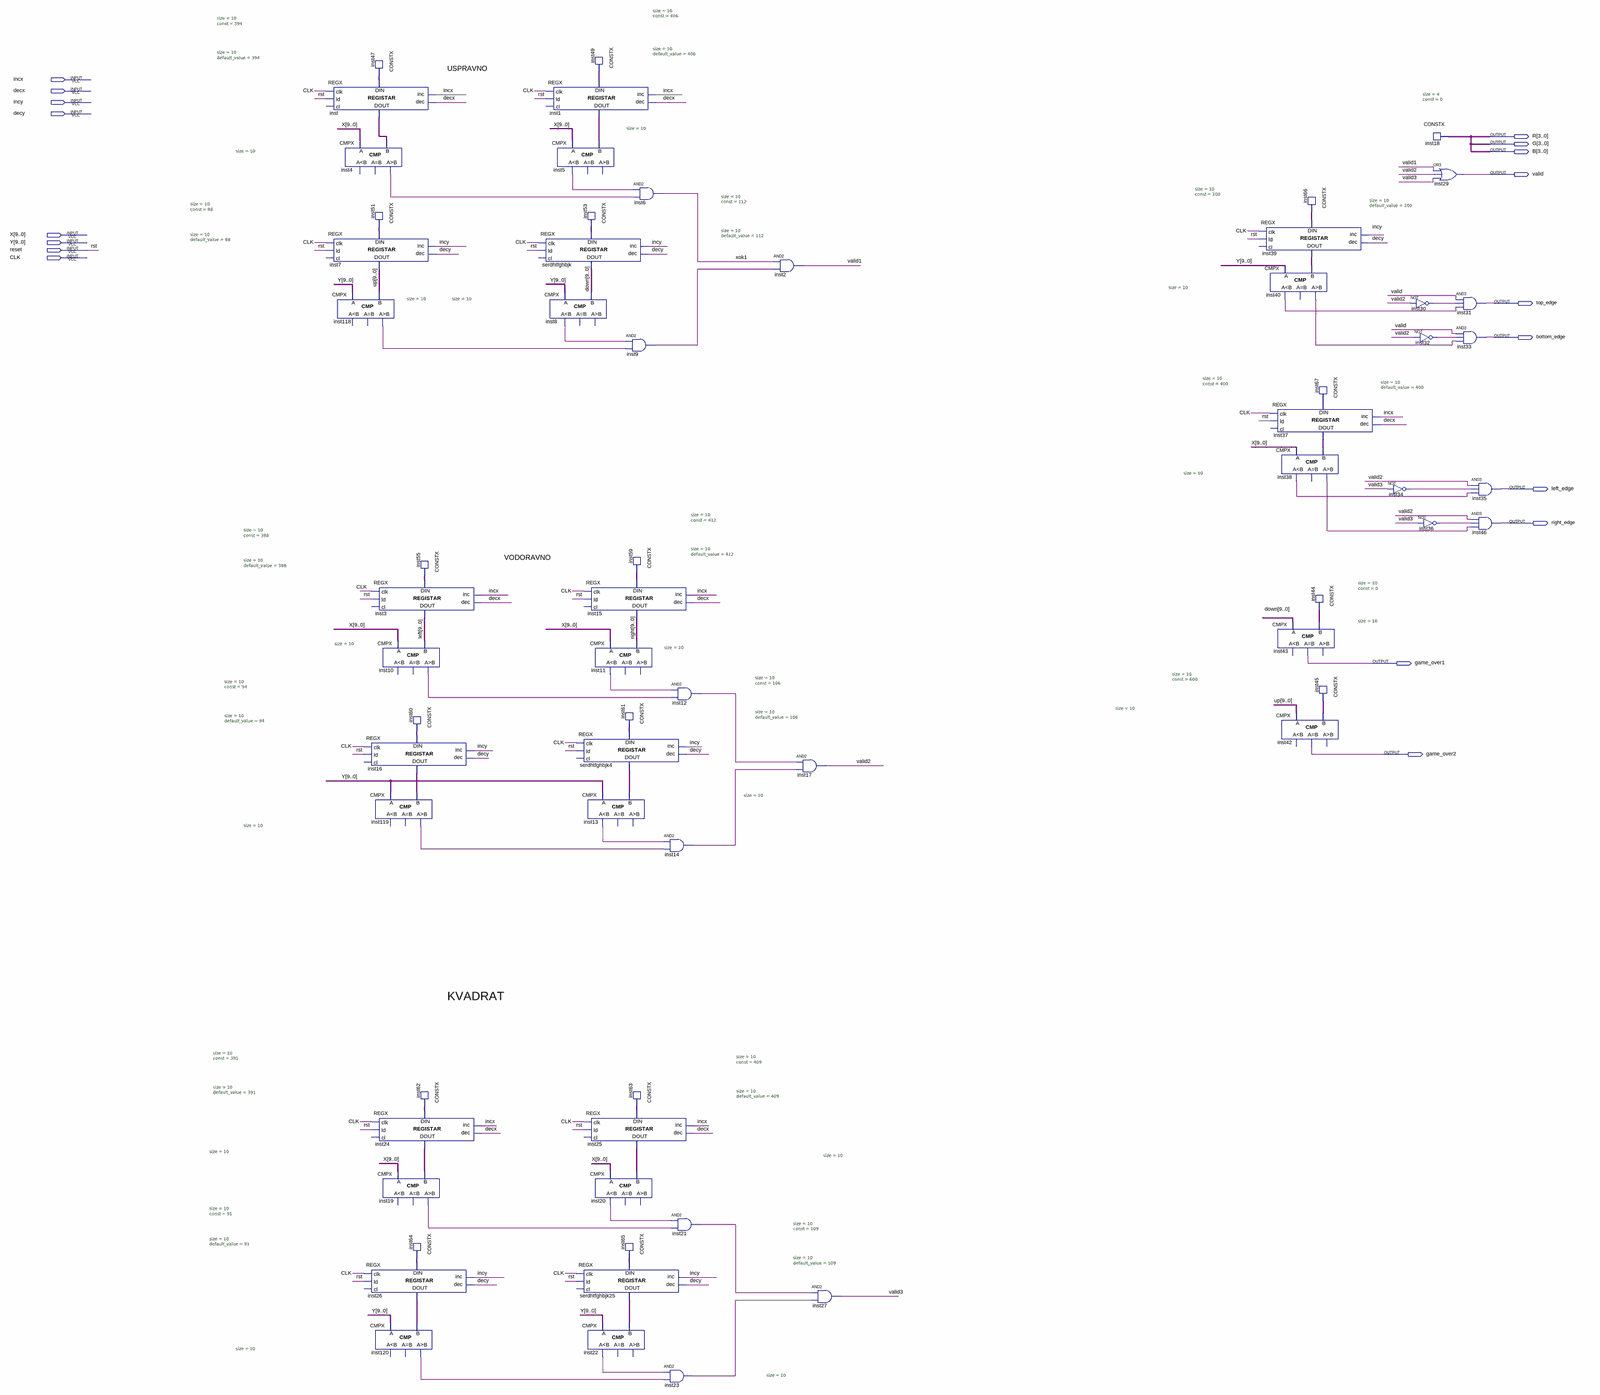
[diagram p0: schematic sheet, whole]
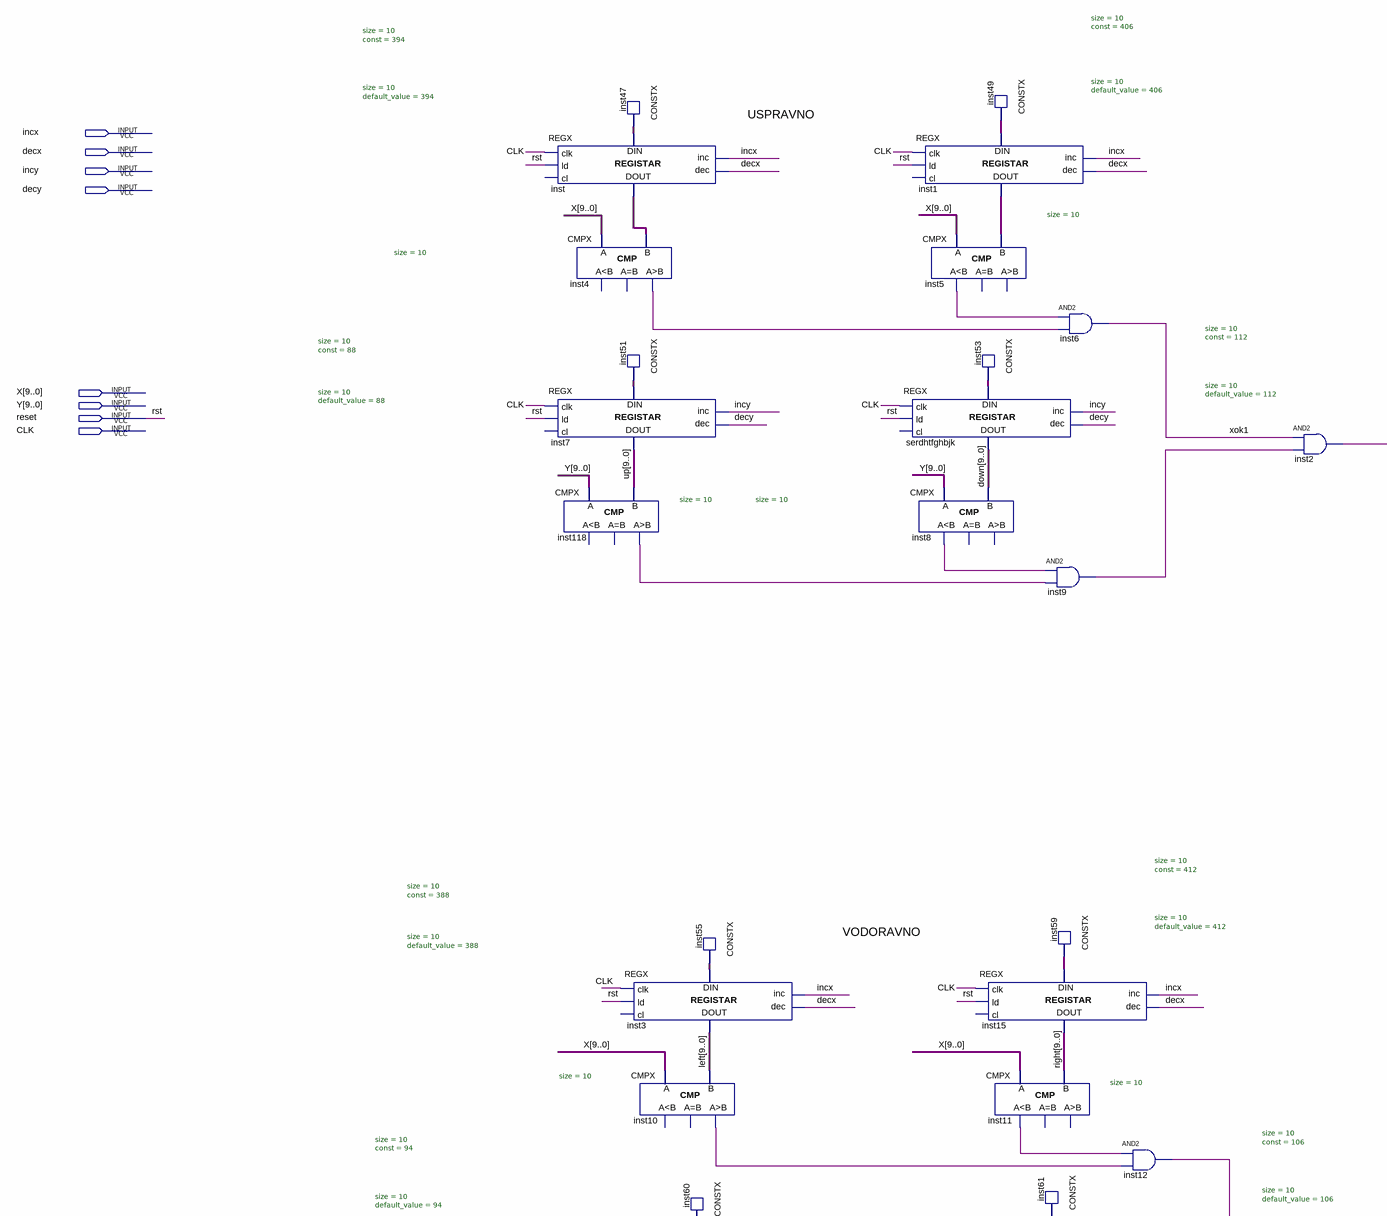
[diagram p1: schematic sheet, upper left part]
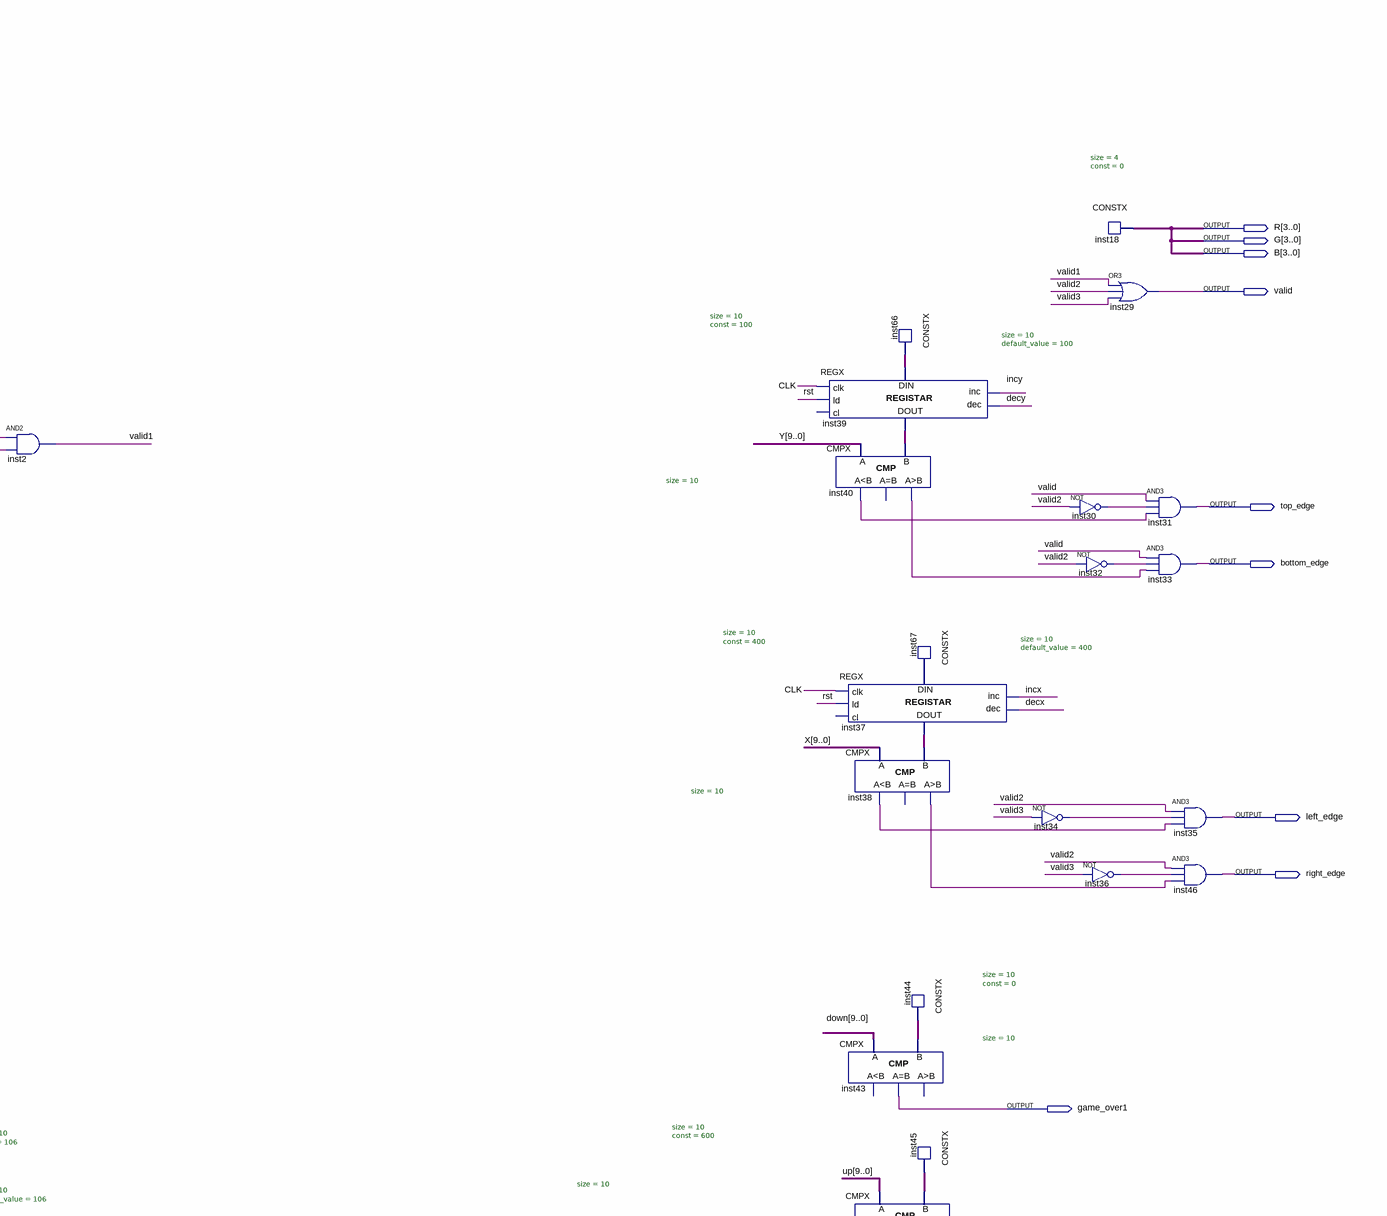
[diagram p2: schematic sheet, upper right part]
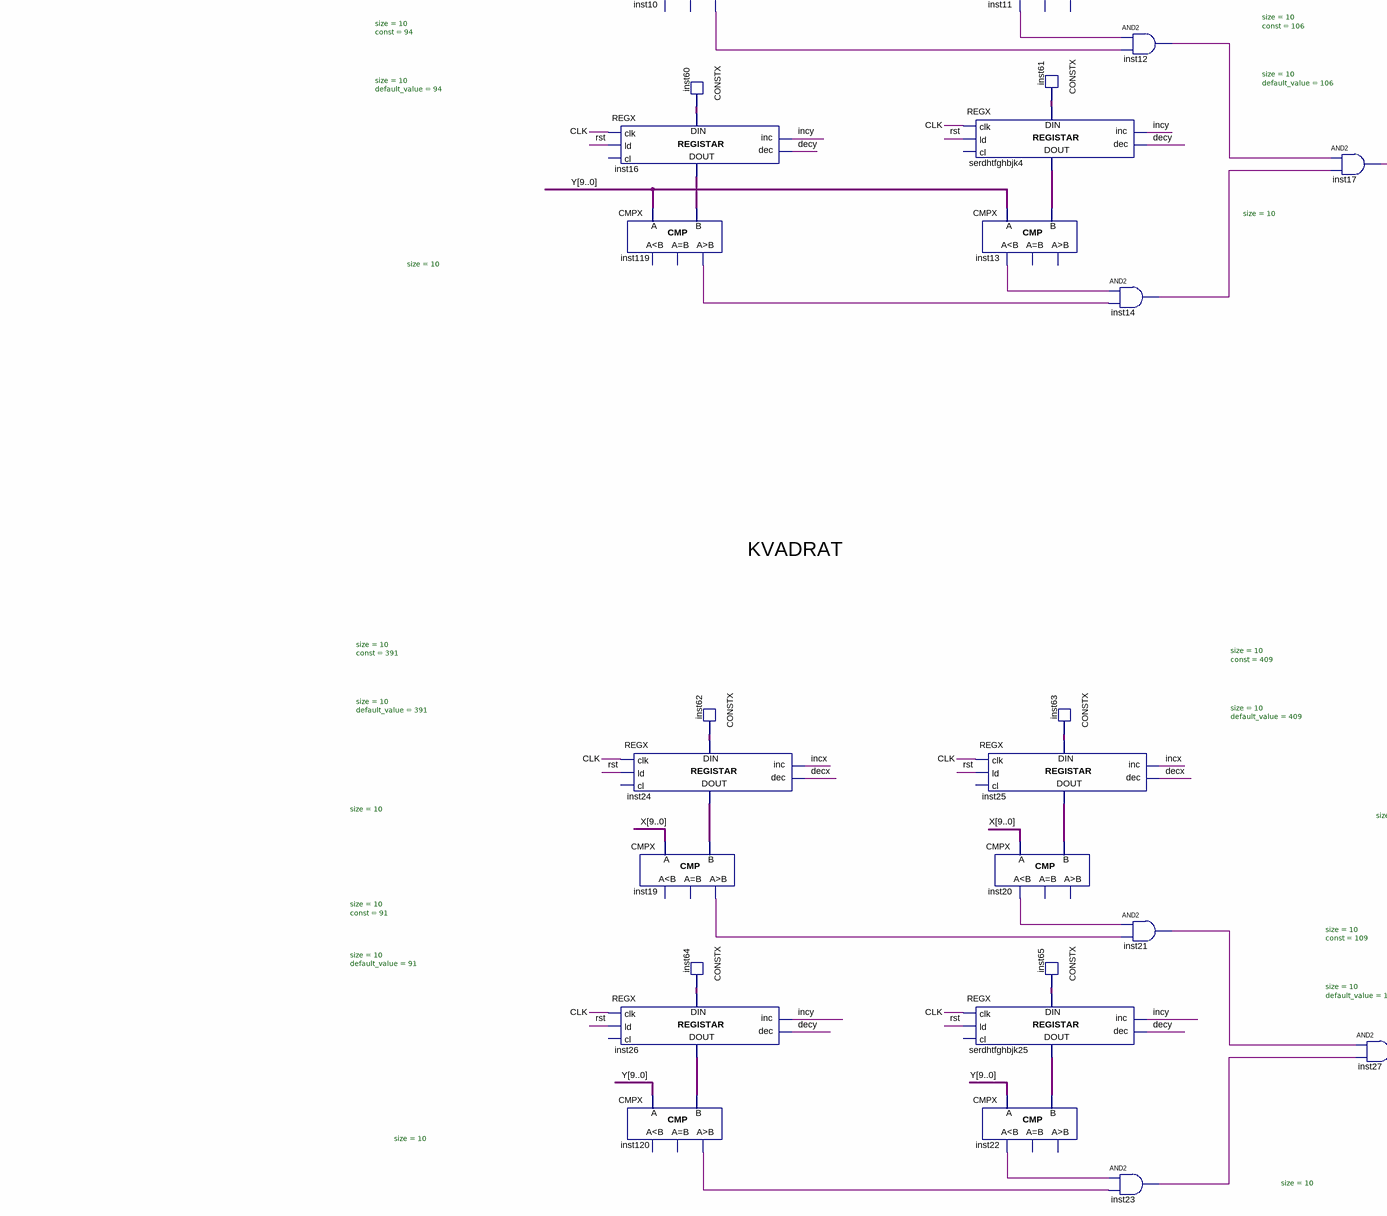
[diagram p3: schematic sheet, lower left part]
// Quartus schematic ball1_interface.bdf as structural Verilog: 65 symbols, 18 pins
module ball1_interface (
  input  incx,
  input  decx,
  input  incy,
  input  decy,
  input  [9:0] X,
  input  [9:0] Y,
  input  reset,
  input  CLK,
  output [3:0] R,
  output [3:0] G,
  output [3:0] B,
  output valid,
  output top_edge,
  output bottom_edge,
  output left_edge,
  output right_edge,
  output game_over1,
  output game_over2
);

  wire inst4_gr, inst5_ls, inst8_ls, inst9_out, inst10_gr, inst11_ls, inst12_out, inst13_ls, inst14_out,
       inst19_gr, inst20_ls, inst21_out, inst22_ls, inst23_out, inst30_out, inst32_out, inst34_out,
       inst36_out, inst38_gr, inst38_ls, inst40_gr, inst40_ls, inst118_gr, inst119_gr, inst120_gr, valid1,
       valid2, valid3, xok1;
  wire [9:0] down, inst1_data_out, inst16_data_out, inst24_data_out, inst25_data_out, inst26_data_out,
       inst37_data_out, inst39_data_out, inst44_data, inst45_data, inst47_data, inst49_data, inst51_data,
       inst53_data, inst55_data, inst59_data, inst60_data, inst61_data, inst62_data, inst63_data,
       inst64_data, inst65_data, inst66_data, inst67_data, inst_data_out, left, right,
       serdhtfghbjk4_data_out, serdhtfghbjk25_data_out, up;

  REGX #(.size(10), .default_value(394)) inst (
    .clk(CLK), .ld(reset), .inc(incx), .dec(decx), .data_in(inst47_data), .data_out(inst_data_out));  // open: cl
  CMPX #(.size(10)) inst4 (.A(X), .B(inst_data_out), .gr(inst4_gr));  // open: ls, eq
  REGX #(.size(10), .default_value(88)) inst7 (
    .clk(CLK), .ld(reset), .inc(incy), .dec(decy), .data_in(inst51_data), .data_out(up));  // open: cl
  CMPX #(.size(10)) inst118 (.A(Y), .B(up), .gr(inst118_gr));  // open: ls, eq
  CONSTX #(.size(10), .\const (394)) inst47 (.data(inst47_data));
  CONSTX #(.size(10), .\const (88)) inst51 (.data(inst51_data));
  REGX #(.size(10), .default_value(94)) inst16 (
    .clk(CLK), .ld(reset), .inc(incy), .dec(decy), .data_in(inst60_data), .data_out(inst16_data_out));  // open: cl
  CMPX #(.size(10)) inst119 (.A(Y), .B(inst16_data_out), .gr(inst119_gr));  // open: ls, eq
  REGX #(.size(10), .default_value(91)) inst26 (
    .clk(CLK), .ld(reset), .inc(incy), .dec(decy), .data_in(inst64_data), .data_out(inst26_data_out));  // open: cl
  CMPX #(.size(10)) inst120 (.A(Y), .B(inst26_data_out), .gr(inst120_gr));  // open: ls, eq
  REGX #(.size(10), .default_value(388)) inst3 (
    .clk(CLK), .ld(reset), .inc(incx), .dec(decx), .data_in(inst55_data), .data_out(left));  // open: cl
  CMPX #(.size(10)) inst10 (.A(X), .B(left), .gr(inst10_gr));  // open: ls, eq
  REGX #(.size(10), .default_value(391)) inst24 (
    .clk(CLK), .ld(reset), .inc(incx), .dec(decx), .data_in(inst62_data), .data_out(inst24_data_out));  // open: cl
  CMPX #(.size(10)) inst19 (.A(X), .B(inst24_data_out), .gr(inst19_gr));  // open: ls, eq
  CONSTX #(.size(10), .\const (388)) inst55 (.data(inst55_data));
  CONSTX #(.size(10), .\const (94)) inst60 (.data(inst60_data));
  CONSTX #(.size(10), .\const (391)) inst62 (.data(inst62_data));
  CONSTX #(.size(10), .\const (91)) inst64 (.data(inst64_data));
  REGX #(.size(10), .default_value(406)) inst1 (
    .clk(CLK), .ld(reset), .inc(incx), .dec(decx), .data_in(inst49_data), .data_out(inst1_data_out));  // open: cl
  CMPX #(.size(10)) inst5 (.A(X), .B(inst1_data_out), .ls(inst5_ls));  // open: eq, gr
  REGX #(.size(10), .default_value(112)) serdhtfghbjk (
    .clk(CLK), .ld(reset), .inc(incy), .dec(decy), .data_in(inst53_data), .data_out(down));  // open: cl
  CMPX #(.size(10)) inst8 (.A(Y), .B(down), .ls(inst8_ls));  // open: eq, gr
  CONSTX #(.size(10), .\const (112)) inst53 (.data(inst53_data));
  REGX #(.size(10), .default_value(106)) serdhtfghbjk4 (
    .clk(CLK), .ld(reset), .inc(incy), .dec(decy), .data_in(inst61_data), .data_out(serdhtfghbjk4_data_out));  // open: cl
  CMPX #(.size(10)) inst13 (.A(Y), .B(serdhtfghbjk4_data_out), .ls(inst13_ls));  // open: eq, gr
  REGX #(.size(10), .default_value(109)) serdhtfghbjk25 (
    .clk(CLK), .ld(reset), .inc(incy), .dec(decy), .data_in(inst65_data), .data_out(serdhtfghbjk25_data_out));  // open: cl
  CMPX #(.size(10)) inst22 (.A(Y), .B(serdhtfghbjk25_data_out), .ls(inst22_ls));  // open: eq, gr
  CONSTX #(.size(10), .\const (406)) inst49 (.data(inst49_data));
  REGX #(.size(10), .default_value(412)) inst15 (
    .clk(CLK), .ld(reset), .inc(incx), .dec(decx), .data_in(inst59_data), .data_out(right));  // open: cl
  CMPX #(.size(10)) inst11 (.A(X), .B(right), .ls(inst11_ls));  // open: eq, gr
  REGX #(.size(10), .default_value(409)) inst25 (
    .clk(CLK), .ld(reset), .inc(incx), .dec(decx), .data_in(inst63_data), .data_out(inst25_data_out));  // open: cl
  CMPX #(.size(10)) inst20 (.A(X), .B(inst25_data_out), .ls(inst20_ls));  // open: eq, gr
  and inst6 (xok1, inst5_ls, inst4_gr);
  and inst9 (inst9_out, inst8_ls, inst118_gr);
  CONSTX #(.size(10), .\const (412)) inst59 (.data(inst59_data));
  CONSTX #(.size(10), .\const (106)) inst61 (.data(inst61_data));
  CONSTX #(.size(10), .\const (409)) inst63 (.data(inst63_data));
  CONSTX #(.size(10), .\const (109)) inst65 (.data(inst65_data));
  and inst12 (inst12_out, inst11_ls, inst10_gr);
  and inst14 (inst14_out, inst13_ls, inst119_gr);
  and inst21 (inst21_out, inst20_ls, inst19_gr);
  and inst23 (inst23_out, inst22_ls, inst120_gr);
  and inst2 (valid1, xok1, inst9_out);
  and inst17 (valid2, inst12_out, inst14_out);
  and inst27 (valid3, inst21_out, inst23_out);
  REGX #(.size(10), .default_value(100)) inst39 (
    .clk(CLK), .ld(reset), .inc(incy), .dec(decy), .data_in(inst66_data), .data_out(inst39_data_out));  // open: cl
  CMPX #(.size(10)) inst40 (.A(Y), .B(inst39_data_out), .ls(inst40_ls), .gr(inst40_gr));  // open: eq
  REGX #(.size(10), .default_value(400)) inst37 (
    .clk(CLK), .ld(reset), .inc(incx), .dec(decx), .data_in(inst67_data), .data_out(inst37_data_out));  // open: cl
  CMPX #(.size(10)) inst38 (.A(X), .B(inst37_data_out), .ls(inst38_ls), .gr(inst38_gr));  // open: eq
  CMPX #(.size(10)) inst43 (.A(down), .B(inst44_data), .eq(game_over1));  // open: ls, gr
  CMPX #(.size(10)) inst42 (.A(up), .B(inst45_data), .eq(game_over2));  // open: ls, gr
  CONSTX #(.size(10), .\const (100)) inst66 (.data(inst66_data));
  CONSTX #(.size(10), .\const (0)) inst44 (.data(inst44_data));
  CONSTX #(.size(10), .\const (400)) inst67 (.data(inst67_data));
  CONSTX #(.size(10), .\const (600)) inst45 (.data(inst45_data));
  not inst34 (inst34_out, valid3);
  CONSTX #(.size(4), .\const (0)) inst18 (.data(B));
  not inst30 (inst30_out, valid2);
  not inst32 (inst32_out, valid2);
  not inst36 (inst36_out, valid3);
  or inst29 (valid, valid1, valid2, valid3);
  and inst31 (top_edge, valid, inst30_out, inst40_ls);
  and inst33 (bottom_edge, valid, inst32_out, inst40_gr);
  and inst35 (left_edge, valid2, inst34_out, inst38_ls);
  and inst46 (right_edge, valid2, inst36_out, inst38_gr);

  assign G = B;
  assign R = B;

  // Other names for the same wires on the sheet: rst = reset

  // Notes on the sheet:
  //   USPRAVNO
  //   VODORAVNO
  //   KVADRAT
endmodule
